# EAGLE design modulo_potencia_rev_2 (EAGLE 5.08)
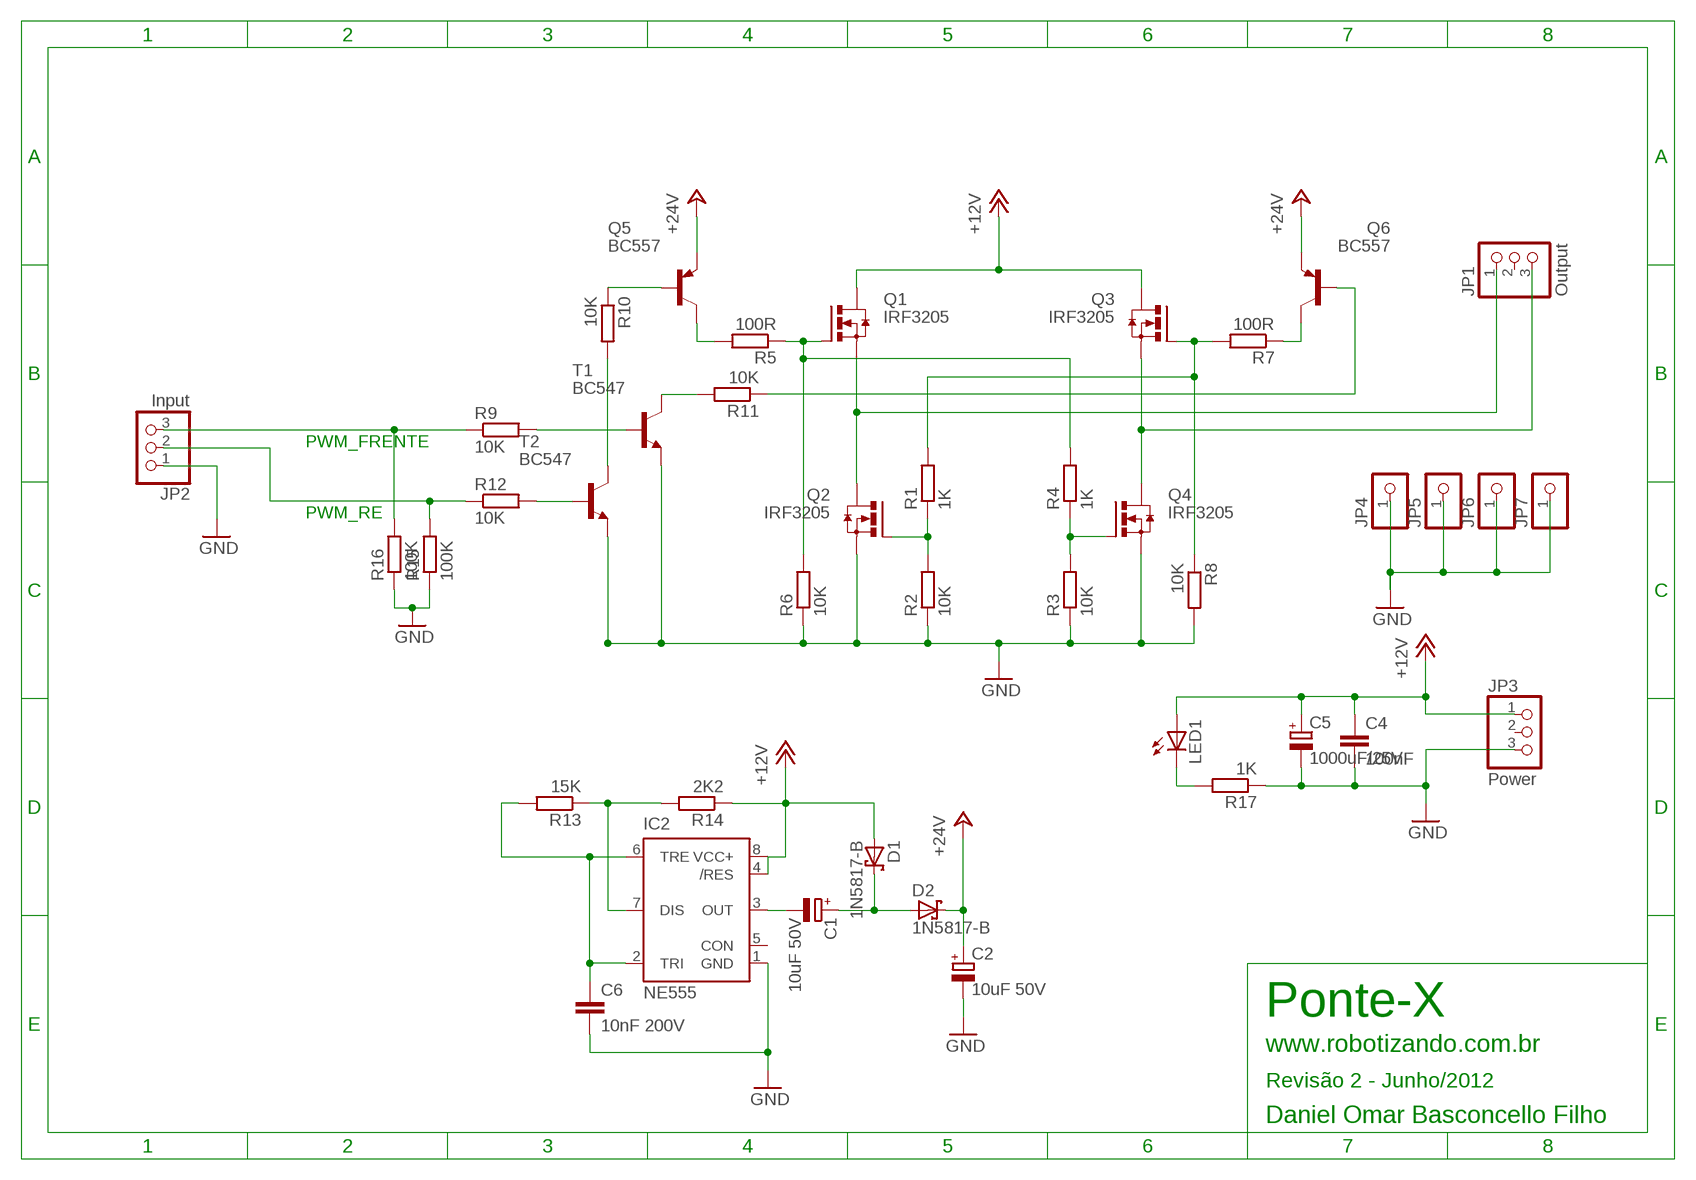
[diagram p0: schematic, sheet 1]

## Parts
C1  10uF 50V  CPOL-EUE2.5-7  [E2,5-7]
C2  10uF 50V  CPOL-EUE2.5-7  [E2,5-7]
C4  100nF  C-EU075-032X103  [C075-032X103]
C5  1000uF/25V  CPOL-EUE5-10.5  [E5-10,5]
C6  10nF 200V  C-EU075-032X103  [C075-032X103]
D1  1N5817-B  [DO41-7.6]
D2  1N5817-B  [DO41-7.6]
IC2  NE555  [DIL-08]
JP1  Output  PINHD-1X3  [1X03]
JP2  Input  PINHD-1X3  [1X03]
JP3  Power  PINHD-1X3  [1X03]
JP4  PINHD-1X1  [1X01]
JP5  PINHD-1X1  [1X01]
JP6  PINHD-1X1  [1X01]
JP7  PINHD-1X1  [1X01]
LED1  LED5MM  [LED5MM]
Q1  IRF3205  IRF3704  [TO220AH]
Q2  IRF3205  IRF3704  [TO220AH]
Q3  IRF3205  IRF3704  [TO220AH]
Q4  IRF3205  IRF3704  [TO220AH]
Q5  BC557  [TO92]
Q6  BC557  [TO92]
R1  1K  R-EU_0207/12  [0207/12]
R2  10K  R-EU_0207/12  [0207/12]
R3  10K  R-EU_0207/12  [0207/12]
R4  1K  R-EU_0207/12  [0207/12]
R5  100R  R-EU_0207/12  [0207/12]
R6  10K  R-EU_0207/12  [0207/12]
R7  100R  R-EU_0207/12  [0207/12]
R8  10K  R-EU_0207/12  [0207/12]
R9  10K  R-EU_0207/12  [0207/12]
R10  10K  R-EU_0207/12  [0207/12]
R11  10K  R-EU_0207/10  [0207/10]
R12  10K  R-EU_0207/12  [0207/12]
R13  15K  R-EU_0204/2V  [0204V]
R14  2K2  R-EU_0204/2V  [0204V]
R15  100K  R-EU_0207/12  [0207/12]
R16  100K  R-EU_0207/12  [0207/12]
R17  1K  R-EU_0207/12  [0207/12]
T1  BC547  [TO92]
T2  BC547  [TO92]

## Nets
+12V [power]: C4.1 C5.+ D1.A IC2.4(/RES) IC2.8(VCC+) JP3.1 LED1.A Q1.C(D) Q3.C(D) R14.1
+24V: C2.+ D2.C Q5.1(E) Q6.1(E)
GND [power]: C2.- C4.2 C5.- C6.2 IC2.1(GND) JP2.1 JP3.3 JP4.1 JP5.1 JP6.1 JP7.1 Q2.E(S) Q4.E(S) R2.1 R3.1 R6.1 R8.2 R15.1 R16.1 R17.1 T1.1(E) T2.1(E)
N$1 [power]: JP1.3 Q3.E(S) Q4.C(D)
N$2: Q2.B(G) R1.1 R2.2
N$3 [power]: JP1.1 Q1.E(S) Q2.C(D)
N$4: Q5.3(C) R5.2
N$5: Q4.B(G) R3.2 R4.1
N$6: Q1.B(G) R4.2 R5.1 R6.2
N$7: Q3.B(G) R1.2 R7.2 R8.1
N$9: Q6.3(C) R7.1
N$10: Q5.2(B) R10.1
N$11: Q6.2(B) R11.1
N$13: R11.2 T1.3(C)
N$14: R10.2 T2.3(C)
N$15: JP2.2 R12.1 R15.2
N$16: C1.- IC2.3(OUT)
N$17 [power]: IC2.7(DIS) R13.1 R14.2
N$18: C1.+ D1.C D2.A
N$19 [power]: LED1.K(C) R17.2
N$20: JP2.3 R9.1 R16.2
N$22 [power]: R12.2 T2.2(B)
N$23 [power]: R9.2 T1.2(B)
N$26 [power]: C6.1 IC2.2(TRI) IC2.6(TRE) R13.2
Unconnected: IC2.5(CON) JP1.2 JP3.2

## Notes on the sheet
- PWM_FRENTE
- PWM_RE
- Ponte-X
- www.robotizando.com.br
- Revisão 2 - Junho/2012
- Daniel Omar Basconcello Filho

## Library data of the parts
C1 C2 C5 = rcl:CPOL-EU: POLARIZED CAPACITOR, European symbol
C4 C6 = rcl:C-EU: CAPACITOR, European symbol
D1 D2 = diode:1N581*: 1.0A SCHOTTKY BARRIER RECTIFIER Source: http://www.diodes.com/datasheets/ds23001.pdf
IC2 = st-microelectronics:NE555: General purpose bipolar Timer
JP1-JP3 = pinhead:PINHD-1X3: PIN HEADER
JP4-JP7 = pinhead:PINHD-1X1: PIN HEADER
LED1 = led:LED: LED OSRAM: - CHIPLED LG R971, LG N971, LY N971, LG Q971, LY Q971, LO R971, LY R971 LH N974, LH R974 LS Q976, LO Q976, LY Q976 LO Q996 - Hyper CHIPLED LW Q18S LB Q993, LB Q99A, LB R99A - SideLED LS A670, LO A670, LY A670, LG A670, LP A670 LB A673, LV A673, LT A673, LW A673 LH A674 LY A675 LS A676, LA A676, LO A676, LY A676, LW A676 LS A679, LY A679, LG A679 - Hyper Micro SIDELED® LS Y876, LA Y876, LO Y876, LY Y876 LT Y87S - SmartLED LW L88C, LW L88S LB L89C, LB L89S, LG L890 LS L89K, LO L89K, LY L89K LS L896, LA L896, LO L896, LY L896 - TOPLED LS T670, LO T670, LY T670, LG T670, LP T670 LSG T670, LSP T670, LSY T670, LOP T670, LYG T670 LG T671, LOG T671, LSG T671 LB T673, LV T673, LT T673, LW T673 LH T674 LS T676, LA T676, LO T676, LY T676, LB T676, LH T676, LSB T676, LW T676 LB T67C, LV T67C, LT T67C, LS T67K, LO T67K, LY T67K, LW E67C LS E67B, LA E67B, LO E67B, LY E67B, LB E67C, LV E67C, LT E67C LW T67C LS T679, LY T679, LG T679 LS T770, LO T770, LY T770, LG T770, LP T770 LB T773, LV T773, LT T773, LW T773 LH T774 LS E675, LA E675, LY E675, LS T675 LS T776, LA T776, LO T776, LY T776, LB T776 LHGB T686 LT T68C, LB T68C - Hyper Mini TOPLED® LB M676 - Mini TOPLED Santana® LG M470 LS M47K, LO M47K, LY M47K Source: http://www.osram.convergy.de LUXEON: - LUMILED® LXK2-PW12-R00, LXK2-PW12-S00, LXK2-PW14-U00, LXK2-PW14-V00 LXK2-PM12-R00, LXK2-PM12-S00, LXK2-PM14-U00 LXK2-PE12-Q00, LXK2-PE12-R00, LXK2-PE12-S00, LXK2-PE14-T00, LXK2-PE14-U00 LXK2-PB12-K00, LXK2-PB12-L00, LXK2-PB12-M00, LXK2-PB14-N00, LXK2-PB14-P00, LXK2-PB14-Q00 LXK2-PR12-L00, LXK2-PR12-M00, LXK2-PR14-Q00, LXK2-PR14-R00 LXK2-PD12-Q00, LXK2-PD12-R00, LXK2-PD12-S00 LXK2-PH12-R00, LXK2-PH12-S00 LXK2-PL12-P00, LXK2-PL12-Q00, LXK2-PL12-R00 Source: www.luxeon.com KINGBRIGHT: KA-3528ASYC Source: www.kingbright.com
Q1-Q4 = transistor-power:IRF3704: SMPS MOSFET HEXFET® Power MOSFET Source: http://www.irf.com/product-info/datasheets/data/irf3704.pdf
Q5 Q6 = transistor-pnp:BC557: PNP Transistor
R1-R17 = rcl:R-EU_: RESISTOR, European symbol
T1 T2 = transistor-neu-to92:BC547: NPN TRANSISTOR

## Net classes
0 default: width 1.016 mm, drill 0.254 mm, clearance 0.762 mm
1 power: width 1.778 mm, drill 0.254 mm, clearance 0.762 mm

## Board
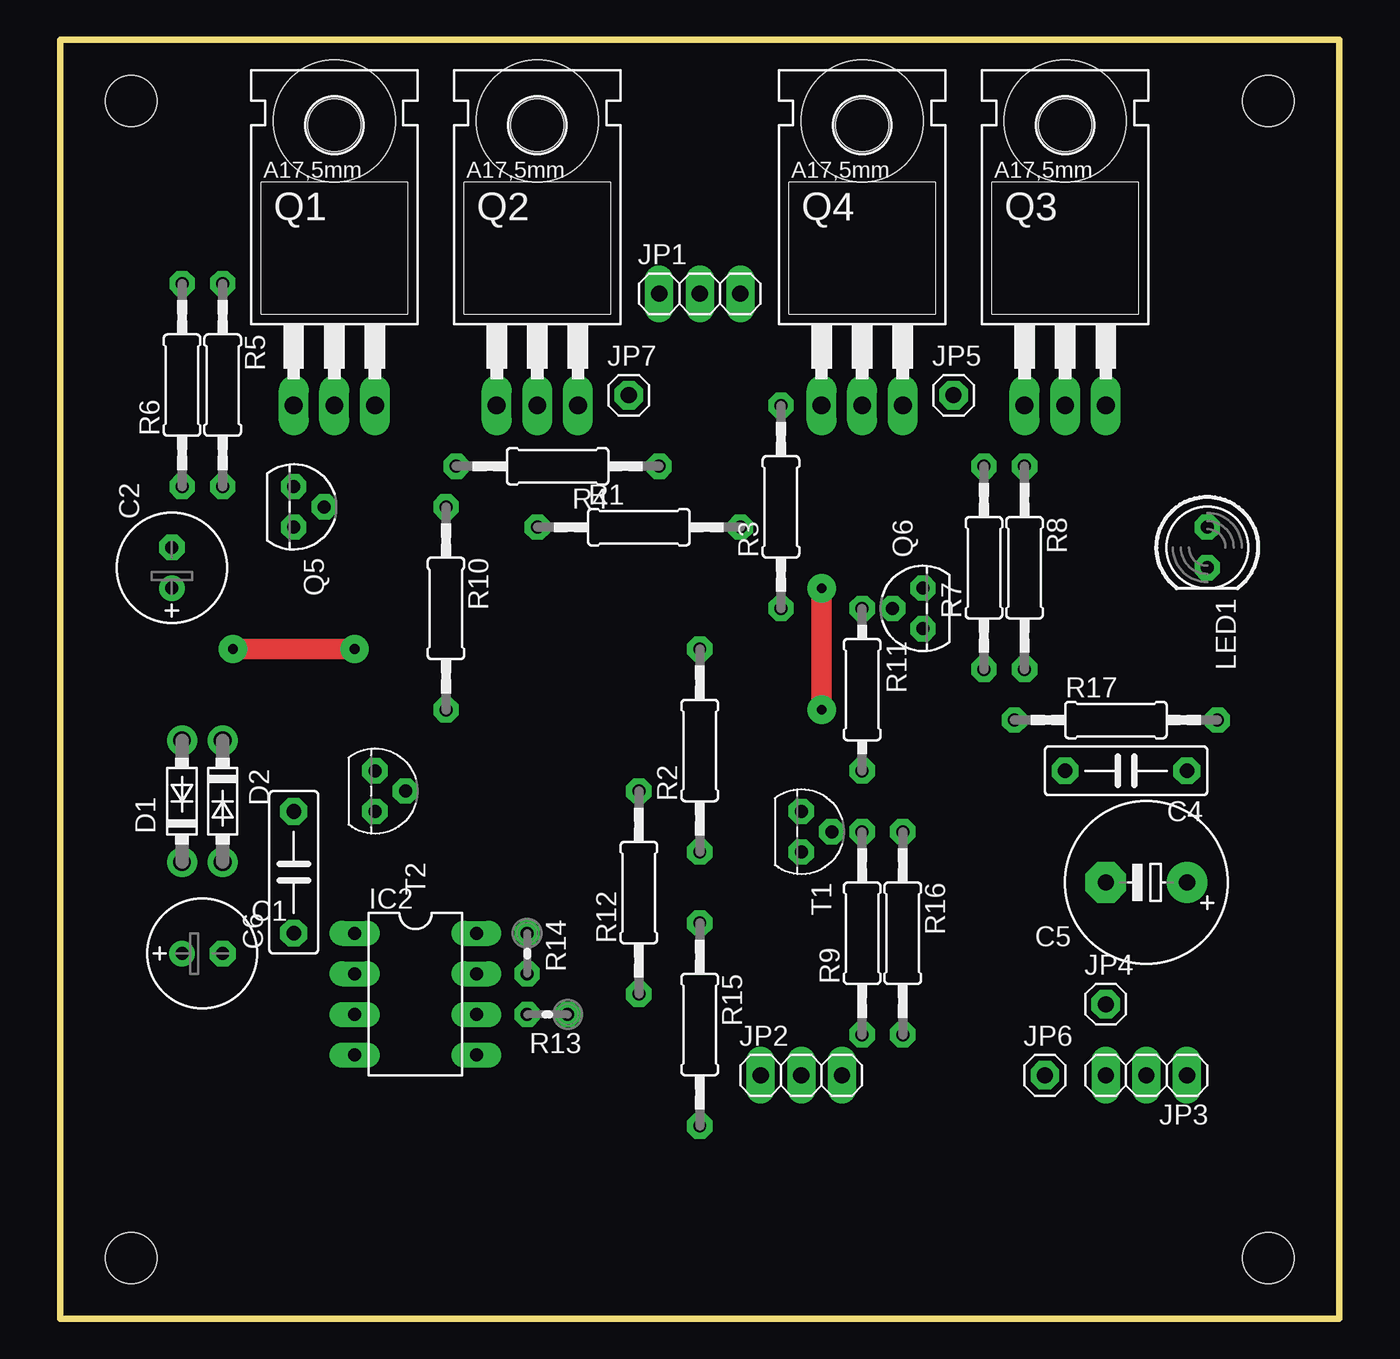
[diagram p1: board, top side]
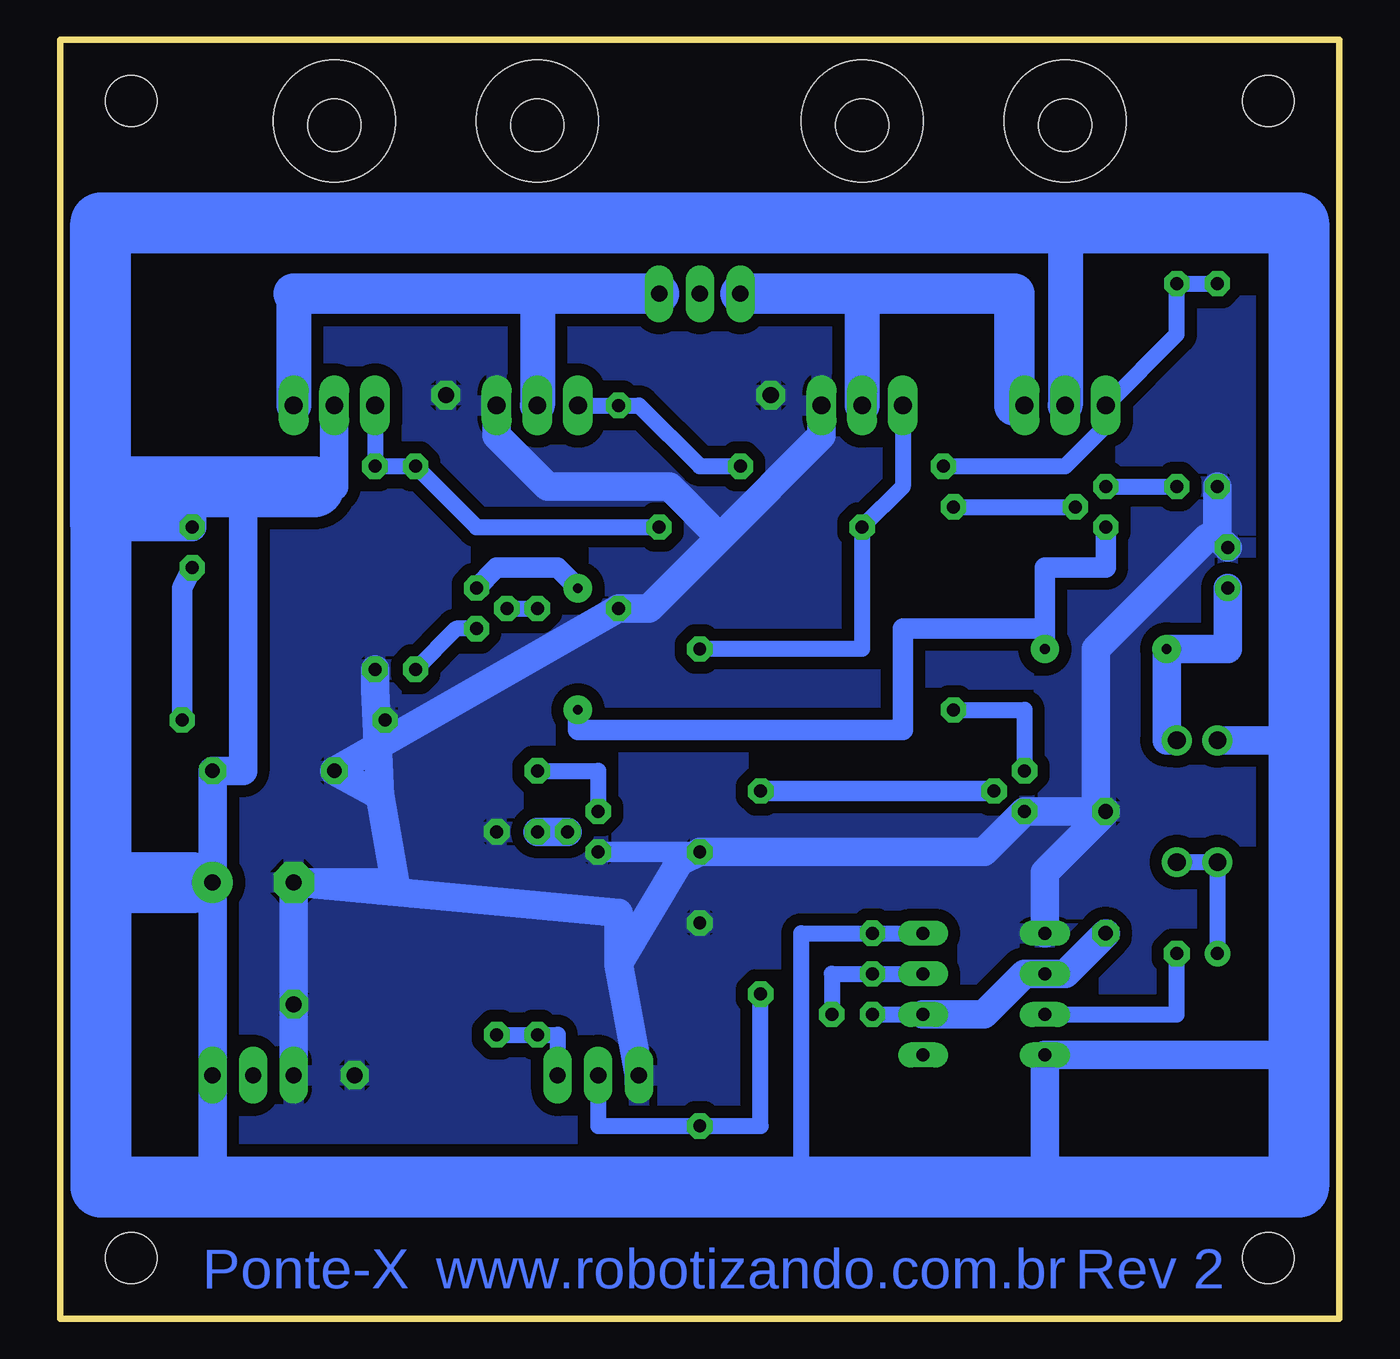
[diagram p2: board, bottom side, seen from below]

Size 80.01 x 80.01 mm. Coordinates in mm from the lower left corner, seen from the top.
Outline: 0,80.01 0,0 80.01,0 80.01,80.01 0,80.01
Copper layers (1*16): Top 0.035mm / dielectric 1.5mm / Bottom 0.035mm
Design rules "default *": minimum track width 10mil, minimum drill 24mil, track to track 8mil, track to pad 8mil, pad to pad 8mil, via to via 8mil, smd to smd 8mil, copper to edge 40mil, drill to drill 8mil, minimum pad ring 15mil, minimum via ring 8mil, stop-mask expansion 4mil, vias tented up to drill 0mil, thermal gap 10mil
Holes 3.2 mm at 4.44,76.2 75.56,76.2 4.44,3.81 75.56,3.81
Holes 7.62 mm at 17.14,74.93 29.84,74.93 50.16,74.93 62.86,74.93

### Footprints (pad centres in the part's own frame; a part is rotated, then mirrored left to right if it is on the bottom)
E2,5-7 = drill 0.813 pad 1.6 round: + -1.27,0 | drill 0.813 pad 1.6 octagon: - 1.27,0
C075-032X103 = drill 0.914 octagon: 1 -3.81,0; 2 3.81,0
E5-10,5 = drill 1.016 pad 2.54 round: + -2.54,0 | drill 1.016 pad 2.54 octagon: - 2.54,0
DO41-7.6 = drill 1.1 pad 1.7 round: A 3.81,0; C -3.81,0
DIL-08 = drill 0.813 long: 1 -3.81,-3.81; 2 -1.27,-3.81; 3 1.27,-3.81; 4 3.81,-3.81; 5 3.81,3.81; 6 1.27,3.81; 7 -1.27,3.81; 8 -3.81,3.81
1X03 = drill 1.016 long: 1 -2.54,0; 2 0,0; 3 2.54,0
1X01 = drill 1.016 octagon: 1 0,0
LED5MM = drill 0.813 octagon: A -1.27,0; K 1.27,0
TO220AH = drill 1.118 long: B -2.54,-6.35; C 0,-6.35; E 2.54,-6.35 | hole 3.302: 0,11.176
TO92 = drill 0.813 octagon: 1 1.27,0; 2 0,1.905; 3 -1.27,0
0207/12 = drill 0.813 octagon: 1 -6.35,0; 2 6.35,0
0207/10 = drill 0.813 octagon: 1 -5.08,0; 2 5.08,0
0204V = drill 0.813 octagon: 1 -1.27,0; 2 1.27,0

### Placement (x,y rotation side)
C1  8.89,22.86 0 top
C2  6.98,46.99 90 top
C4  66.67,34.29 180 top
C5  67.94,27.3 180 top
C6  14.6,27.94 90 top
D1  7.62,32.38 90 top
D2  10.16,32.38 270 top
IC2  22.22,20.32 270 top
JP1  40,64.14 0 top
JP2  46.35,15.24 0 top
JP3  67.94,15.24 180 top
JP4  65.41,19.68 0 top
JP5  55.88,57.79 0 top
JP6  61.59,15.24 0 top
JP7  35.56,57.79 0 top
LED1  71.75,48.26 270 top
Q1  17.14,63.5 0 top
Q2  29.84,63.5 0 top
Q3  62.86,63.5 0 top
Q4  50.16,63.5 0 top
Q5  14.6,50.8 270 top
Q6  53.97,44.45 90 top
R1  36.19,49.53 0 top
R2  40,35.56 90 top
R3  45.08,50.8 90 top
R4  31.11,53.34 180 top
R5  10.16,58.42 270 top
R6  7.62,58.42 90 top
R7  57.78,46.99 90 top
R8  60.32,46.99 270 top
R9  50.16,24.13 90 top
R10  24.13,44.45 270 top
R11  50.16,39.37 270 top
R12  36.19,26.67 90 top
R13  30.48,19.05 180 top
R14  29.21,22.86 270 top
R15  40,18.41 270 top
R16  52.7,24.13 270 top
R17  66.04,37.47 0 top
T1  46.35,30.48 270 top
T2  19.68,33.02 270 top

### Tracks (layer width: path | path; a pad name or v marks a point on that pad's centre or on a via)
+12V
  Bottom 1.016: IC2.8 R14.1 33.66,24.13 33.66,8.26 31.75,7.62
  Bottom 1.778: 68.58,52.07 62.86,52.07 Q3.C | 68.58,52.07 68.58,34.29 C4.1 C5.+ JP3.1 70.48,8.26 | 18.41,8.26 IC2.4 2.54,16.51 | 30.48,8.26 31.75,7.62 | 68.58,52.07 71.75,52.07 LED1.A 77.47,49.53 | 2.54,36.2 D1.A
  Bottom 2.184: 17.14,68.58 Q1.C
  Bottom 3.81: 77.47,27.3 77.47,49.53 77.47,68.58 17.14,68.58 2.54,68.58 2.54,36.2 2.54,16.51 2.54,8.26 18.41,8.26 30.48,8.26 33.66,8.26 70.48,8.26 77.47,8.26 77.47,27.3 | 77.47,27.3 71.75,27.3
+24V  (via drill 0.6 pad 1.78)
  Top 1.27: v18.41,41.91 v10.8,41.91 | v47.62,45.72 v47.62,38.1
  Bottom 1.27: 18.41,43.18 18.41,46.99 14.6,46.99 Q5.1 | 18.41,43.18 v18.41,41.91 | 18.41,43.18 27.3,43.18 27.3,36.83 47.62,36.83 v47.62,38.1 | Q6.1 52.7,46.99 48.89,46.99 v47.62,45.72
  Bottom 1.778: D2.C 10.8,36.2 v10.8,41.91 6.98,41.91 C2.+
GND
  Bottom 1.27: R2.1 T1.1
  Bottom 1.778: C5.- JP3.3 | R8.2 60.32,39.37 60.01,32.7 | 60.01,32.7 C4.2 R3.1 43.18,44.45 38.73,48.9 | Q2.E 32.38,55.25 38.73,48.9 | Q4.E 52.7,55.25 49.53,52.07 41.91,52.07 38.73,48.9 | C5.- 59.05,27.3 60.01,32.7 | 7.62,48.9 R6.1 | 7.62,48.9 C2.- | IC2.1 18.41,27.94 C6.2 15.24,31.75 | 15.24,31.75 15.24,41.91 8.25,48.9 7.62,48.9 | 45.08,22.22 JP2.1 | 45.08,22.22 41.27,28.57 R2.1 22.22,29.21 T2.1 15.24,31.75 | C5.- 45.08,25.4 45.08,22.22
  pour Bottom: 1.91,68.58 77.47,69.21 77.47,7.62 3.17,8.89
N$1
  Bottom 2.184: 50.16,64.14 Q4.C | 65.41,64.14 Q3.E
  Bottom 2.54: JP1.3 50.16,64.14 65.41,64.14
N$2
  Bottom 1.016: R2.2 29.84,41.91 R1.1 27.3,52.07 Q2.B
N$3
  Bottom 1.778: 20.32,57.15 Q1.E
  Bottom 2.184: 29.84,64.14 Q2.C
  Bottom 2.54: JP1.1 29.84,64.14 20.32,64.14 20.32,57.15
N$4
  Bottom 1.016: Q5.3 R5.2
N$5
  Bottom 1.016: R4.1 40,53.34 43.81,57.15 R3.2 Q4.B
N$6
  Bottom 1.016: R6.2 R5.1 10.16,61.6 Q1.B 14.6,55.88 17.14,53.34 R4.2
N$7
  Bottom 1.016: R1.2 53.97,49.53 R7.2 R8.1 Q3.B
N$8
  Bottom 3.81: 76.83,52.07 64.13,52.07
N$9
  Bottom 1.016: Q6.3 55.24,43.18 R7.1
N$10
  Bottom 1.016: R10.1 Q5.2
N$11
  Bottom 1.016: Q6.2 R11.1
N$13
  Bottom 1.016: R11.2 46.35,34.29 T1.3
N$14
  Bottom 1.016: R10.2 19.68,38.1 T2.3
N$15
  Bottom 1.016: R12.1 36.19,12.06 R15.2 46.35,12.06 JP2.2
N$16
  Bottom 1.016: IC2.3 10.16,19.05 C1.-
N$17
  Bottom 1.016: IC2.7 R14.2 31.75,21.59 R13.1
N$18
  Bottom 1.016: C1.+ D1.C D2.A
N$19
  Bottom 1.27: LED1.K 72.39,45.72 R17.2
N$20
  Bottom 1.016: JP2.3 48.89,17.78 R9.1 R16.2
N$22
  Bottom 1.27: R12.2 T2.2
N$23
  Bottom 1.778: T1.2 R9.2
N$26
  Bottom 1.016: R13.2 IC2.6
  Bottom 1.778: C6.1 17.14,21.59 IC2.2 19.68,21.59 22.22,19.05 IC2.6

### Text on the board
Bottom: Rev 2 | www.robotizando.com.br | Ponte-X
Document: inB | inA | gnd | +12